# Altium schematic sheet ROTARY_SW.SchDoc
size A4
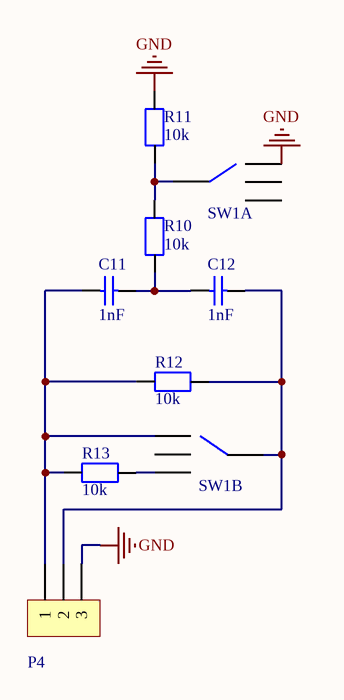
[diagram p0: ROTARY_SW.SchDoc]

## Parts
C11  value 1nF  [0805_Capacitor]  (hidden comment: Capacitor)
C12  value 1nF  [0805_Capacitor]  (hidden comment: Capacitor)
P4  SIL-CONN-3  [SIL-CONN-3-R1]  (value not drawn)
R10  value 10k  [0805_Resistor]  (hidden comment: Resistor)
R11  value 10k  [0805_Resistor]  (hidden comment: Resistor)
R12  value 10k  [0805_Resistor]  (hidden comment: Resistor)
R13  value 10k  [0805_Resistor]  (hidden comment: Resistor)
SW1  SRBM131400  [SRBM131400]  (value not drawn)  (parts A,B of 2)

## Nets
GND: P4.3 R11.2 SW1.2
NetC11_1: C11.1 P4.1 R12.2 R13.2 SW1.6
NetC11_2: C11.2 C12.1 R10.1
NetC12_2: C12.2 P4.2 R12.1 SW1.10
NetR10_2: R10.2 R11.1 SW1.1
NetR13_1: R13.1 SW1.8

Not connected (* = marked no-connect by the designer): SW1 3 4 7